# EAGLE design aquarium (EAGLE 9.5.2)

## Sheet 1 of 2
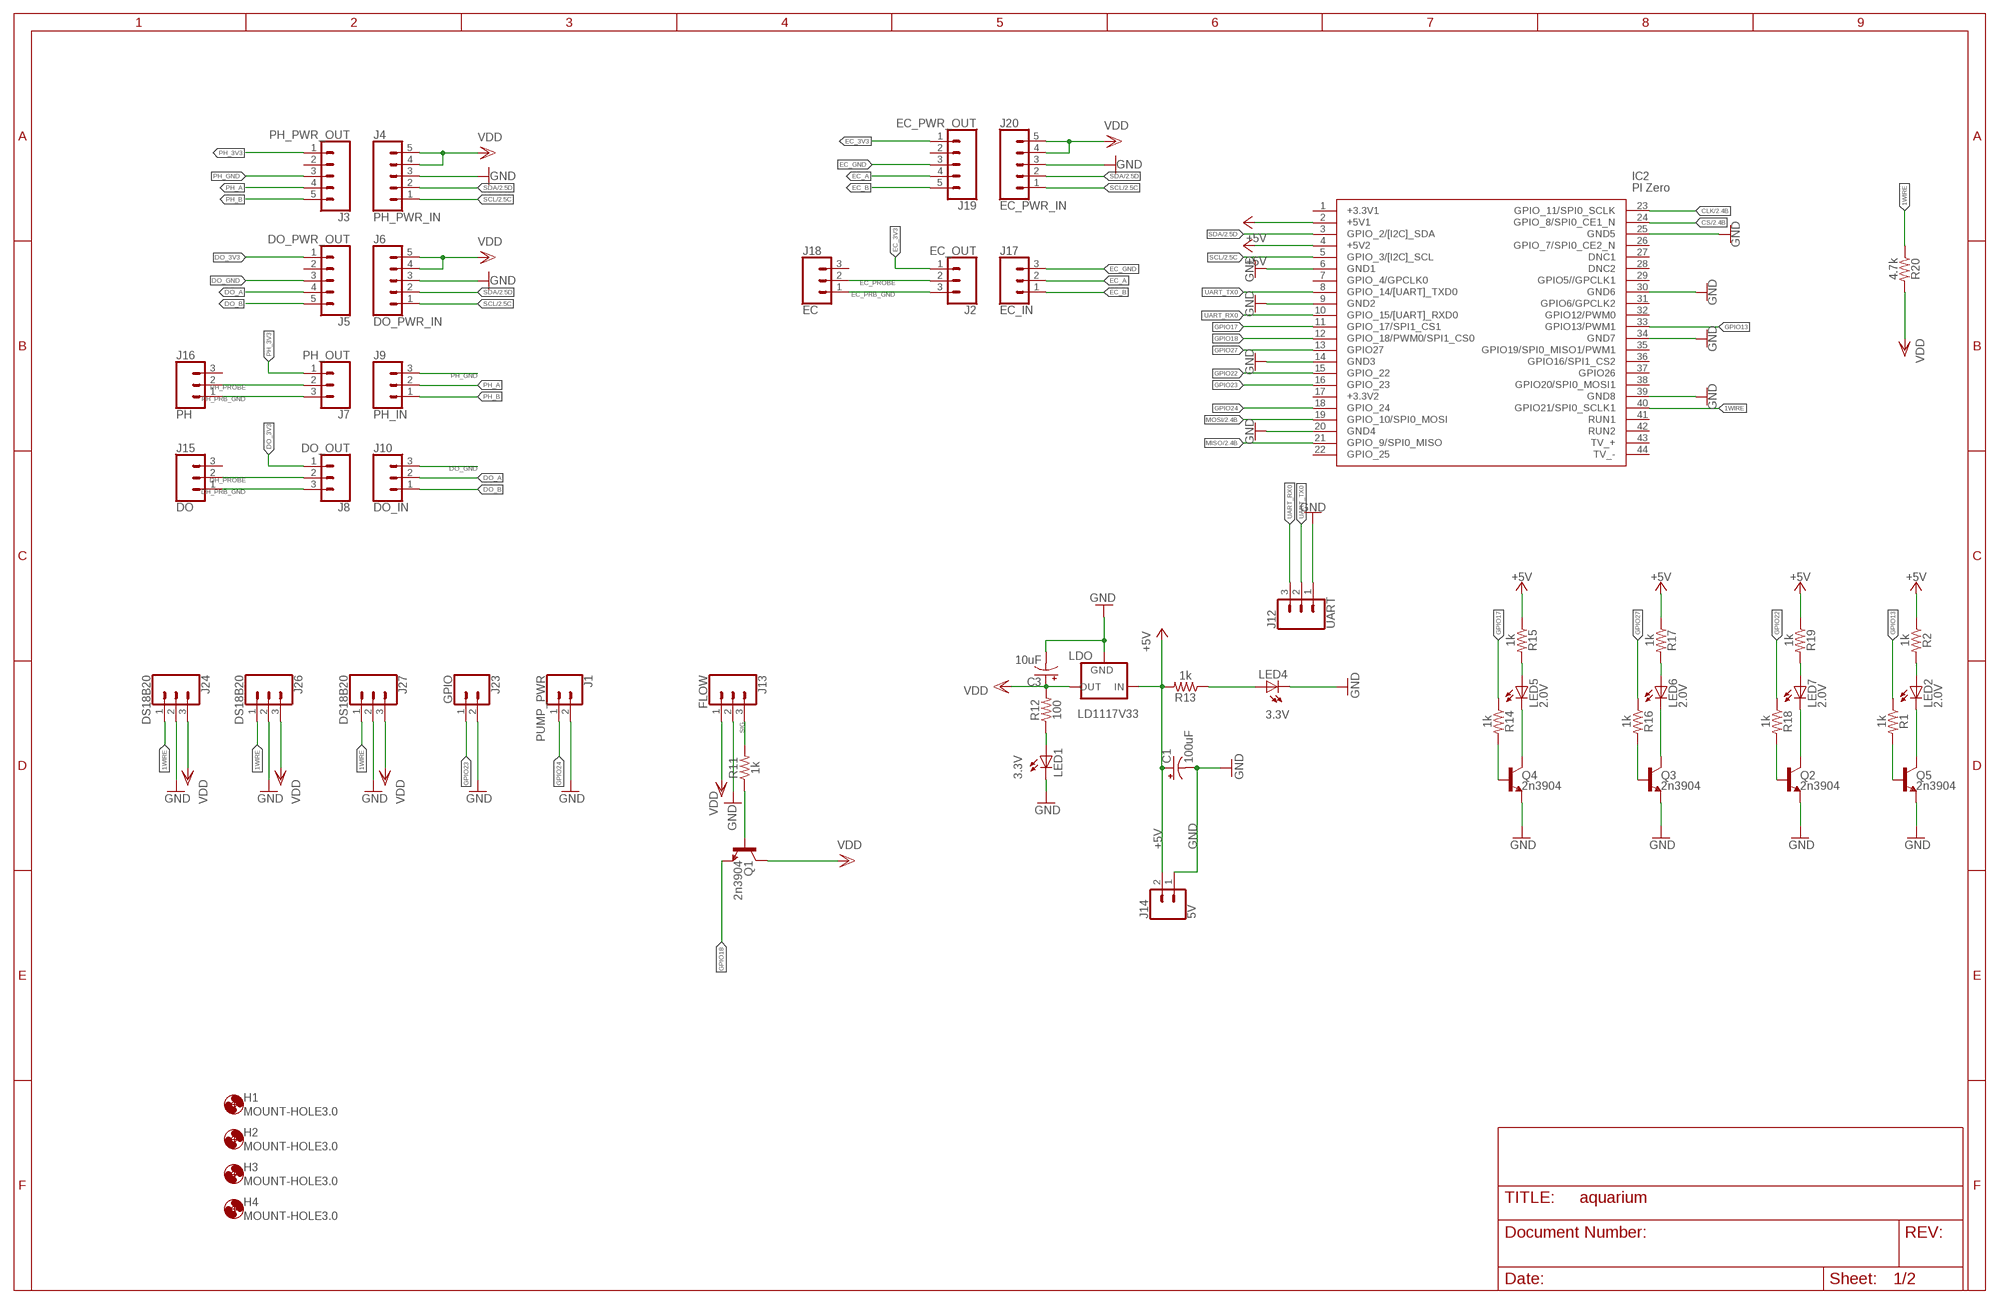
[diagram p0: schematic, sheet 1]

### Parts
C1  100uF  100UF-POLAR-RADIAL-2.5MM-25V-20%  [CPOL-RADIAL-2.5MM-6.5MM]
C3  10uF  10UF-POLAR-RADIAL-2.5MM-25V-20%  [CPOL-RADIAL-2.5MM-5MM]
H1  MOUNT-HOLE3.0  [3,0]
H2  MOUNT-HOLE3.0  [3,0]
H3  MOUNT-HOLE3.0  [3,0]
H4  MOUNT-HOLE3.0  [3,0]
IC2  PI Zero  RASPBERRY_PI_ZERO_W_(V1.3)  [RASPBERRYPIZEROWV13]
J1  PUMP_PWR  CONN_02  [1X02]
J2  EC_OUT  CONN_03  [1X03]
J3  PH_PWR_OUT  CONN_05  [1X05]
J4  PH_PWR_IN  CONN_05  [1X05]
J5  DO_PWR_OUT  CONN_05  [1X05]
J6  DO_PWR_IN  CONN_05  [1X05]
J7  PH_OUT  CONN_03  [1X03]
J8  DO_OUT  CONN_03  [1X03]
J9  PH_IN  CONN_03  [1X03]
J10  DO_IN  CONN_03  [1X03]
J12  UART  CONN_03  [1X03]
J13  FLOW  CONN_03  [1X03]
J14  5V  CONN_02  [1X02]
J15  DO  CONN_03  [1X03]
J16  PH  CONN_03  [1X03]
J17  EC_IN  CONN_03  [1X03]
J18  EC  CONN_03  [1X03]
J19  EC_PWR_OUT  CONN_05  [1X05]
J20  EC_PWR_IN  CONN_05  [1X05]
J23  GPIO  CONN_02  [1X02]
J24  DS18B20  CONN_03  [1X03]
J26  DS18B20  CONN_03  [1X03]
J27  DS18B20  CONN_03  [1X03]
LDO  LD1117V33  V_REG_LD1117VXX  [78XXL]
LED1  3.3V  LED3MM  [LED3MM]
LED2  2.0V  LED3MM  [LED3MM]
LED4  3.3V  LED3MM  [LED3MM]
LED5  2.0V  LED3MM  [LED3MM]
LED6  2.0V  LED3MM  [LED3MM]
LED7  2.0V  LED3MM  [LED3MM]
Q1  2n3904  TRANS_NPN-2N3904  [TO-92]
Q2  2n3904  TRANS_NPN-2N3904  [TO-92]
Q3  2n3904  TRANS_NPN-2N3904  [TO-92]
Q4  2n3904  TRANS_NPN-2N3904  [TO-92]
Q5  2n3904  TRANS_NPN-2N3904  [TO-92]
R1  1k  1KOHM-HORIZ-1/4W-5%  [AXIAL-0.3]
R2  1k  1KOHM-HORIZ-1/4W-5%  [AXIAL-0.3]
R11  1k  1KOHM-HORIZ-1/4W-5%  [AXIAL-0.3]
R12  100  1KOHM-HORIZ-1/4W-5%  [AXIAL-0.3]
R13  1k  1KOHM-HORIZ-1/4W-5%  [AXIAL-0.3]
R14  1k  1KOHM-HORIZ-1/4W-5%  [AXIAL-0.3]
R15  1k  1KOHM-HORIZ-1/4W-5%  [AXIAL-0.3]
R16  1k  1KOHM-HORIZ-1/4W-5%  [AXIAL-0.3]
R17  1k  1KOHM-HORIZ-1/4W-5%  [AXIAL-0.3]
R18  1k  1KOHM-HORIZ-1/4W-5%  [AXIAL-0.3]
R19  1k  1KOHM-HORIZ-1/4W-5%  [AXIAL-0.3]
R20  4.7k  1KOHM-HORIZ-1/4W-5%  [AXIAL-0.3]

### Nets
1WIRE: IC2.40(GPIO21/SPI0_SCLK1) J24.1 J26.1 J27.1 R20.P$1
+5V: C1.1(+) IC2.2(+5V1) IC2.4(+5V2) J14.2 LDO.OUT(IN) R2.P$1 R13.P$2 R15.P$1 R17.P$1 R19.P$1 ; also sheet 2
CLK: IC2.23(GPIO_11/SPI0_SCLK) ; also sheet 2
CS: IC2.24(GPIO_8/SPI0_CE1_N) ; also sheet 2
DH_PRB_GND: J8.3 J15.1
DH_PROBE: J8.2 J15.2
DO_3V3: J5.1 J8.1
DO_A: J5.4 J10.2
DO_B: J5.5 J10.1
DO_GND: J5.3 J10.3
EC_3V3: J2.1 J19.1
EC_A: J17.2 J19.4
EC_B: J17.1 J19.5
EC_GND: J17.3 J19.3
EC_PRB_GND: J2.3 J18.1
EC_PROBE: J2.2 J18.2
GND: C1.2(-) C3.2(-) IC2.6(GND1) IC2.9(GND2) IC2.14(GND3) IC2.20(GND4) IC2.25(GND5) IC2.30(GND6) IC2.34(GND7) IC2.39(GND8) J1.2 J4.3 J6.3 J12.1 J13.2 J14.1 J20.3 J23.2 J24.2 J26.2 J27.2 LDO.IN(GND) LED1.K(C) LED4.K(C) Q2.1(E) Q3.1(E) Q4.1(E) Q5.1(E) ; also sheet 2
GPIO13: IC2.33(GPIO13/PWM1) R1.P$1
GPIO17: IC2.11(GPIO_17/SPI1_CS1) R14.P$1
GPIO18: IC2.12(GPIO_18/PWM0/SPI1_CS0) Q1.1(E)
GPIO22: IC2.15(GPIO_22) R18.P$1
GPIO23: IC2.16(GPIO_23) J23.1
GPIO24: IC2.18(GPIO_24) J1.1
GPIO27: IC2.13(GPIO27) R16.P$1
MISO: IC2.21(GPIO_9/SPI0_MISO) ; also sheet 2
MOSI: IC2.19(GPIO_10/SPI0_MOSI) ; also sheet 2
N$1: LED1.A R12.P$1
N$2: Q1.2(B) R11.P$1
N$3: Q4.2(B) R14.P$2
N$4: LED4.A R13.P$1
N$5: Q3.2(B) R16.P$2
N$6: LED5.A R15.P$2
N$7: Q2.2(B) R18.P$2
N$8: LED5.K(C) Q4.3(C)
N$9: LED6.A R17.P$2
N$10: LED6.K(C) Q3.3(C)
N$11: LED7.A R19.P$2
N$12: LED7.K(C) Q2.3(C)
N$13: Q5.2(B) R1.P$2
N$14: LED2.A R2.P$2
N$15: LED2.K(C) Q5.3(C)
PH_3V3: J3.1 J7.1
PH_A: J3.4 J9.2
PH_B: J3.5 J9.1
PH_GND: J3.3 J9.3
PH_PRB_GND: J7.3 J16.1
PH_PROBE: J7.2 J16.2
SCL: IC2.5(GPIO_3/[I2C]_SCL) J4.1 J6.1 J20.1 ; also sheet 2
SDA: IC2.3(GPIO_2/[I2C]_SDA) J4.2 J6.2 J20.2 ; also sheet 2
SIG: J13.3 R11.P$2
UART_RX0: IC2.10(GPIO_15/[UART]_RXD0) J12.3
UART_TX0: IC2.8(GPIO_14/[UART]_TXD0) J12.2
VDD: C3.1(+) J4.4 J4.5 J6.4 J6.5 J13.1 J20.4 J20.5 J24.3 J26.3 J27.3 LDO.GND(OUT) Q1.3(C) R12.P$2 R20.P$2 ; also sheet 2
Unconnected: IC2.1(+3.3V1) IC2.7(GPIO_4/GPCLK0) IC2.17(+3.3V2) IC2.22(GPIO_25) IC2.26(GPIO_7/SPI0_CE2_N) IC2.27(DNC1) IC2.28(DNC2) IC2.29(GPIO5//GPCLK1) IC2.31(GPIO6/GPCLK2) IC2.32(GPIO12/PWM0) IC2.35(GPIO19/SPI0_MISO1/PWM1) IC2.36(GPIO16/SPI1_CS2) IC2.37(GPIO26) IC2.38(GPIO20/SPI0_MOSI1) IC2.41(RUN1) IC2.42(RUN2) IC2.43(TV_+) IC2.44(TV_-) J3.2 J5.2 J15.3 J16.3 J18.3 J19.2

## Sheet 2 of 2
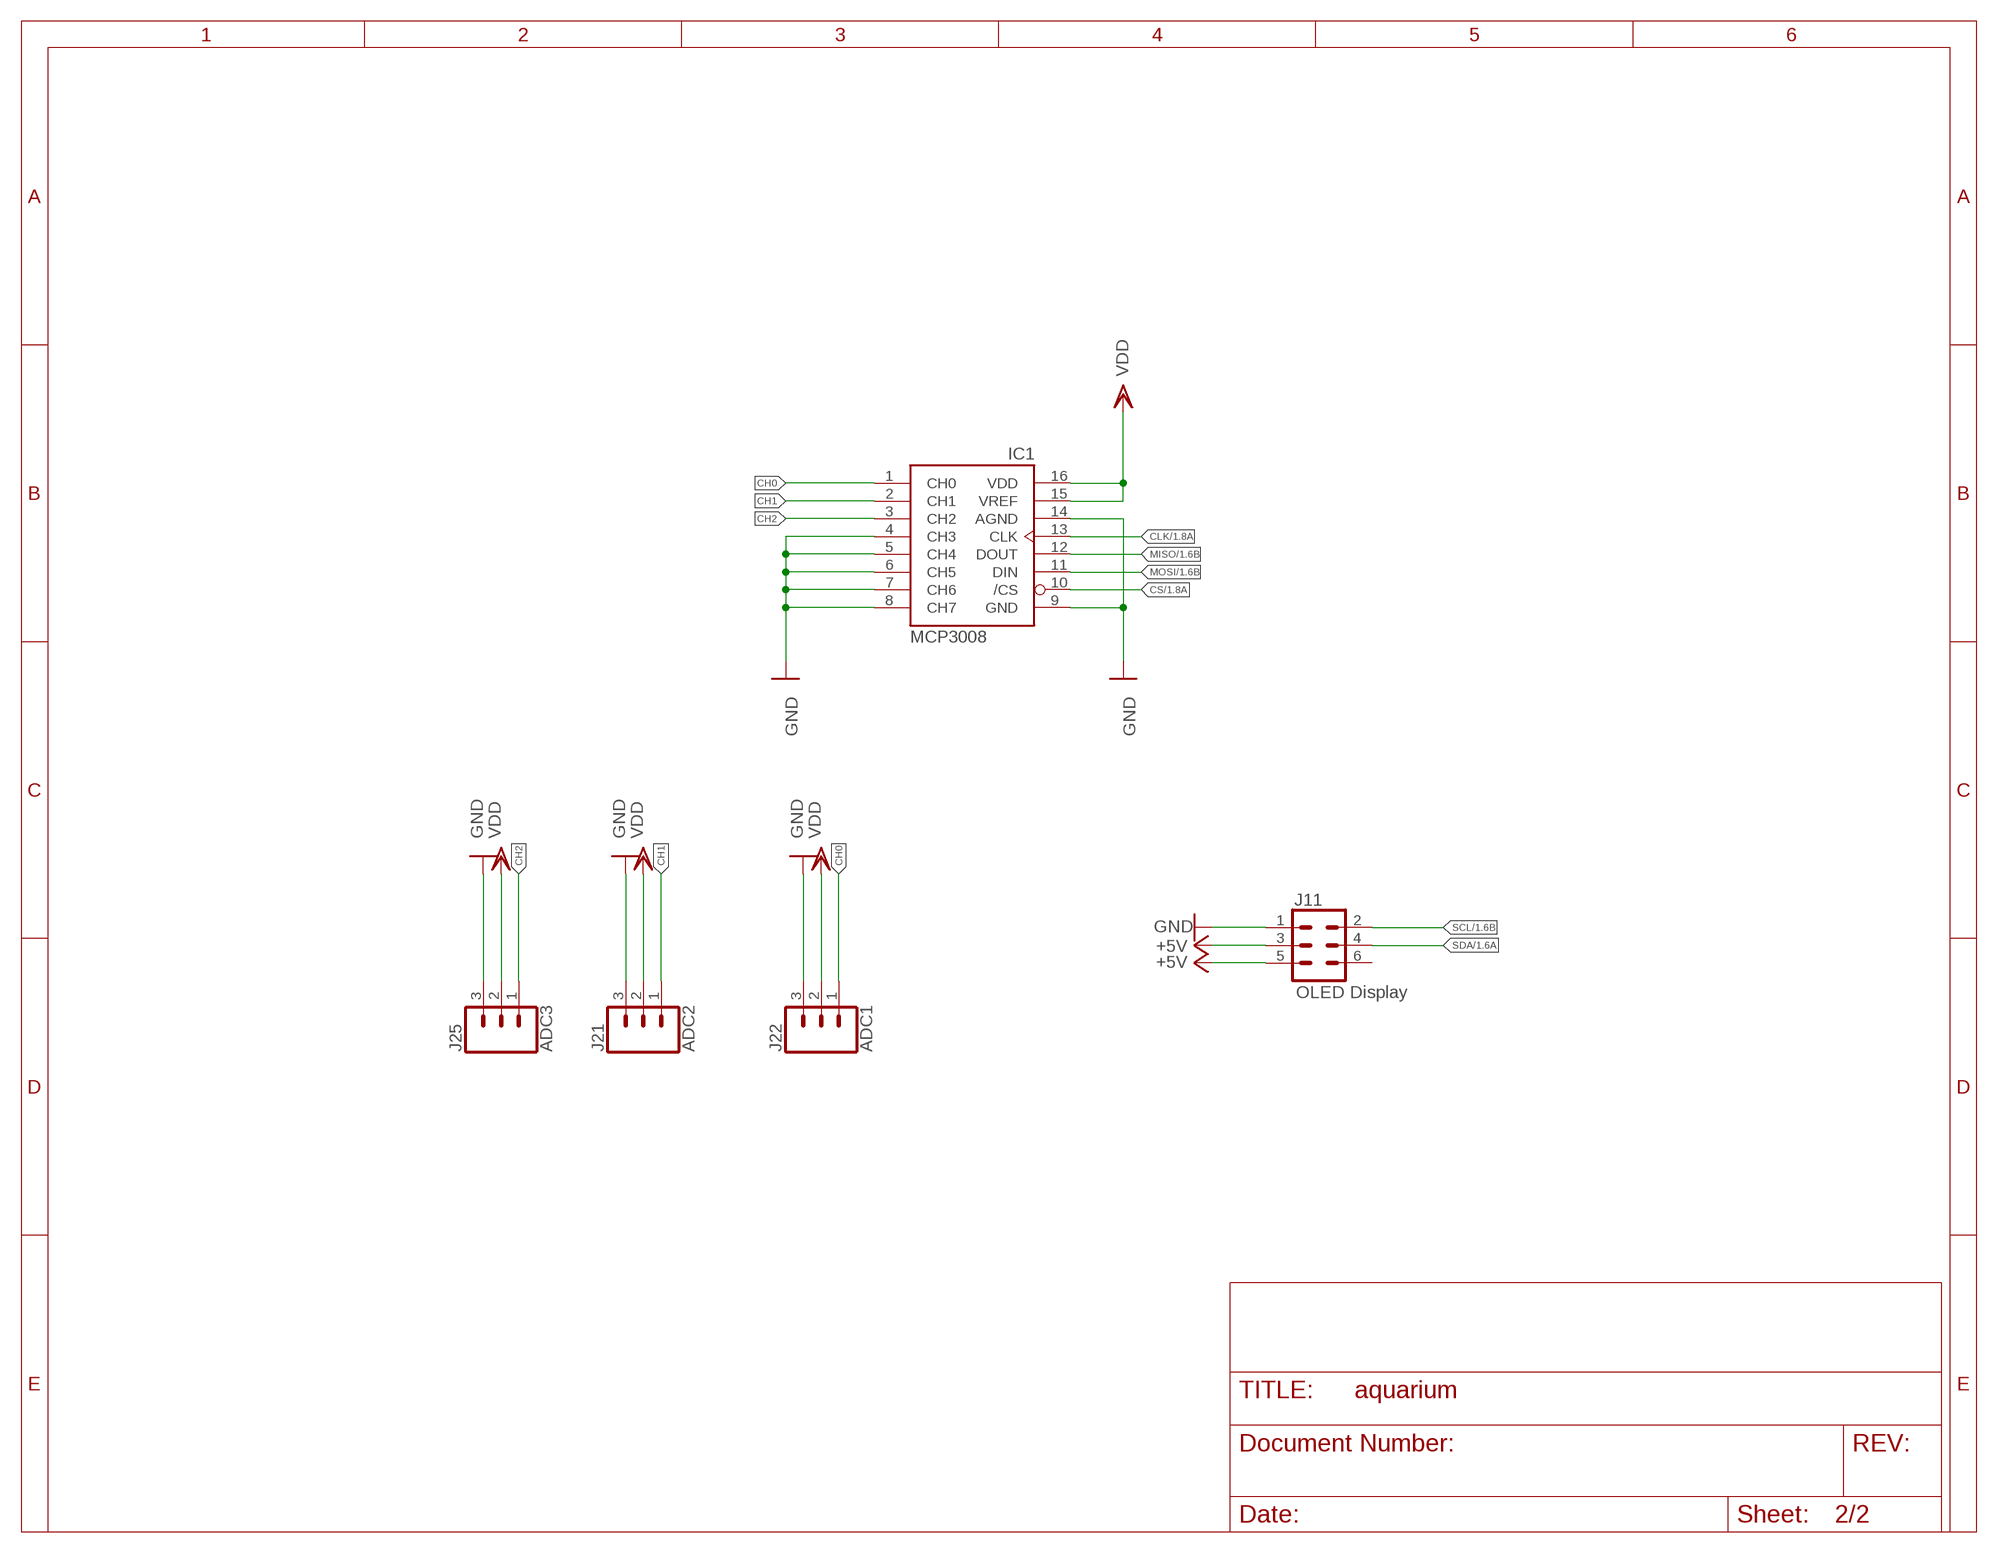
[diagram p1: schematic, sheet 2]

### Parts
IC1  MCP3008  [DIL16]
J11  OLED Display  CONN_03X2FEMALE  [2X3]
J21  ADC2  CONN_03  [1X03]
J22  ADC1  CONN_03  [1X03]
J25  ADC3  CONN_03  [1X03]

### Nets
+5V: J11.3 J11.5 ; also sheet 1
CH0: IC1.1(CH0) J22.1
CH1: IC1.2(CH1) J21.1
CH2: IC1.3(CH2) J25.1
CLK: IC1.13(CLK) ; also sheet 1
CS: IC1.10(/CS) ; also sheet 1
GND: IC1.4(CH3) IC1.5(CH4) IC1.6(CH5) IC1.7(CH6) IC1.8(CH7) IC1.9(GND) IC1.14(AGND) J11.1 J21.3 J22.3 J25.3 ; also sheet 1
MISO: IC1.12(DOUT) ; also sheet 1
MOSI: IC1.11(DIN) ; also sheet 1
SCL: J11.2 ; also sheet 1
SDA: J11.4 ; also sheet 1
VDD: IC1.15(VREF) IC1.16(VDD) J21.2 J22.2 J25.2 ; also sheet 1
Unconnected: J11.6

## Library data of the parts
C1 = SparkFun-Capacitors:100UF-POLAR: 100µF polarized capacitors A capacitor is a passive two-terminal electrical component used to store electrical energy temporarily in an electric field.; PROD_ID: CAP-08439
C3 = SparkFun-Capacitors:10UF-POLAR: 10.0µF polarized capacitors A capacitor is a passive two-terminal electrical component used to store electrical energy temporarily in an electric field.; PROD_ID: CAP-08440
H1-H4 = holes:MOUNT-HOLE: MOUNTING HOLE with drill center marker
IC1 = adafruit:MCP3008
IC2 = Rasbperry_Pi_Zero_W:RASPBERRY_PI_ZERO_W_(V1.3): Raspberry Pi Zero W (v1.3) Single-board Computers Source: Datasheet <https://cdn.sparkfun.com/assets/learn_tutorials/6/7/6/PiZero_1.pdf>; ARROW_PART_NUMBER: Raspberry Pi Zero W (v1.3); DESCRIPTION: Raspberry Pi Zero W (v1.3) Single-board Computers; HEIGHT: mm; MANUFACTURER_NAME: RASPBERRY-PI; MANUFACTURER_PART_NUMBER: Raspberry Pi Zero W (v1.3)
J1 J14 J23 = SparkFun-Connectors:CONN_02: Multi connection point. Often used as Generic Header-pin footprint for 0.1 inch spaced/style header connections On any of the 0.1 inch spaced packages, you can populate with these: Break Away Headers - Straight <https://www.sparkfun.com/products/116> (PRT-00116) Break Away Male Headers - Right Angle <https://www.sparkfun.com/products/553> (PRT-00553) Female Headers <https://www.sparkfun.com/products/115> (PRT-00115) Break Away Headers - Machine Pin <https://www.sparkfun.com/products/117> (PRT-00117) Break Away Female Headers - Swiss Machine Pin <https://www.sparkfun.com/products/743> (PRT-00743) For SCREWTERMINALS and SPRING TERMINALS visit here: Screw Terimnals on SparkFun.com <https://www.sparkfun.com/search/results?term=Screw+Terminals> (5mm/3.5mm/2.54mm spacing) This device is also useful as a general connection point to wire up your design to another part of your project. Our various solder wires solder well into these plated through hole pads. Hook-Up Wire - Assortment (Stranded, 22 AWG) <https://www.sparkfun.com/products/11375> (PRT-11375) Hook-Up Wire - Assortment (Solid Core, 22 AWG) <https://www.sparkfun.com/products/11367> (PRT-11367) View the entire wire category on our website here <https://www.sparkfun.com/categories/141> Special notes: Molex polarized connector foot print use with: PRT-08233 with associated crimp pins and housings. 2.54_SCREWTERM for use with PRT-10571. 3.5mm Screw Terminal footprints for PRT-08084 5mm Screw Terminal footprints for use with PRT-08432
J2 J7-J10 J12 J13 J15-J18 J21 J22 J24-J27 = SparkFun-Connectors:CONN_03: Multi connection point. Often used as Generic Header-pin footprint for 0.1 inch spaced/style header connections On any of the 0.1 inch spaced packages, you can populate with these: Break Away Headers - Straight <https://www.sparkfun.com/products/116> (PRT-00116) Break Away Male Headers - Right Angle <https://www.sparkfun.com/products/553> (PRT-00553) Female Headers <https://www.sparkfun.com/products/115> (PRT-00115) Break Away Headers - Machine Pin <https://www.sparkfun.com/products/117> (PRT-00117) Break Away Female Headers - Swiss Machine Pin <https://www.sparkfun.com/products/743> (PRT-00743) Stackable Header - 3 Pin (Female, 0.1") <https://www.sparkfun.com/products/13875> (PRT-13875) For SCREWTERMINALS and SPRING TERMINALS visit here: Screw Terimnals on SparkFun.com <https://www.sparkfun.com/search/results?term=Screw+Terminals> (5mm/3.5mm/2.54mm spacing) This device is also useful as a general connection point to wire up your design to another part of your project. Our various solder wires solder well into these plated through hole pads. Hook-Up Wire - Assortment (Stranded, 22 AWG) <https://www.sparkfun.com/products/11375> (PRT-11375) Hook-Up Wire - Assortment (Solid Core, 22 AWG) <https://www.sparkfun.com/products/11367> (PRT-11367) View the entire wire category on our website here <https://www.sparkfun.com/categories/141> Special notes: Molex polarized connector foot print use with SKU : PRT-08232 with associated crimp pins and housings.
J3-J6 J19 J20 = SparkFun-Connectors:CONN_05: Multi connection point. Often used as Generic Header-pin footprint for 0.1 inch spaced/style header connections On any of the 0.1 inch spaced packages, you can populate with these: Break Away Headers - Straight <https://www.sparkfun.com/products/116> (PRT-00116) Break Away Male Headers - Right Angle <https://www.sparkfun.com/products/553> (PRT-00553) Female Headers <https://www.sparkfun.com/products/115> (PRT-00115) Break Away Headers - Machine Pin <https://www.sparkfun.com/products/117> (PRT-00117) Break Away Female Headers - Swiss Machine Pin <https://www.sparkfun.com/products/743> (PRT-00743) For SCREWTERMINALS and SPRING TERMINALS visit here: Screw Terimnals on SparkFun.com <https://www.sparkfun.com/search/results?term=Screw+Terminals> (5mm/3.5mm/2.54mm spacing) This device is also useful as a general connection point to wire up your design to another part of your project. Our various solder wires solder well into these plated through hole pads. Hook-Up Wire - Assortment (Stranded, 22 AWG) <https://www.sparkfun.com/products/11375> (PRT-11375) Hook-Up Wire - Assortment (Solid Core, 22 AWG) <https://www.sparkfun.com/products/11367> (PRT-11367) View the entire wire category on our website here <https://www.sparkfun.com/categories/141> Special notes: Molex polarized connector foot print use with SKU : PRT-08231 with associated crimp pins and housings. 1MM SMD Version SKU: PRT-10208
J11 = SparkFun-Connectors:CONN_03X2: Multi connection point. Often used as Generic Header-pin footprint for 0.1 inch spaced/style header connections You can populate with any combo of single row headers, but if you'd like an exact match, check these: Header - 2x3 (Male, 0.1") <https://www.sparkfun.com/products/12807> (PRT-12807) Header - 2x3 (Female, 0.1") <https://www.sparkfun.com/products/13010> (PRT-13010) 2x3 Pin Shrouded Header <https://www.sparkfun.com/products/10877> (PRT-10877) On any of the 0.1 inch spaced packages, you can populate with these: Break Away Headers - Straight <https://www.sparkfun.com/products/116> (PRT-00116) Break Away Male Headers - Right Angle <https://www.sparkfun.com/products/553> (PRT-00553) Female Headers <https://www.sparkfun.com/products/115> (PRT-00115) Break Away Headers - Machine Pin <https://www.sparkfun.com/products/117> (PRT-00117) Break Away Female Headers - Swiss Machine Pin <https://www.sparkfun.com/products/743> (PRT-00743) Special note: the shrouded connector mates well with our 3x2 ribbon cables: Ribbon Crimp Connector - 6-pin (2x3, Female) <https://www.sparkfun.com/products/10651> (PRT-10651) Ribbon Cable - 6 wire (15ft) <https://www.sparkfun.com/products/10646> (PRT-10646); PROD_ID: CONN-11566; VALUE: FEMALE 2x3
LDO = SparkFun-IC-Power:V_REG_LD1117VXX: LD1117VXX voltage regulator. We carry the 3.3V version (COM-00526) in TO-220 package.
LED1 LED2 LED4-LED7 = adafruit:LED: LED OSRAM: - CHIPLED LG R971, LG N971, LY N971, LG Q971, LY Q971, LO R971, LY R971 LH N974, LH R974 LS Q976, LO Q976, LY Q976 LO Q996 - Hyper CHIPLED LW Q18S LB Q993, LB Q99A, LB R99A - SideLED LS A670, LO A670, LY A670, LG A670, LP A670 LB A673, LV A673, LT A673, LW A673 LH A674 LY A675 LS A676, LA A676, LO A676, LY A676, LW A676 LS A679, LY A679, LG A679 - Hyper Micro SIDELED® LS Y876, LA Y876, LO Y876, LY Y876 LT Y87S - SmartLED LW L88C, LW L88S LB L89C, LB L89S, LG L890 LS L89K, LO L89K, LY L89K LS L896, LA L896, LO L896, LY L896 - TOPLED LS T670, LO T670, LY T670, LG T670, LP T670 LSG T670, LSP T670, LSY T670, LOP T670, LYG T670 LG T671, LOG T671, LSG T671 LB T673, LV T673, LT T673, LW T673 LH T674 LS T676, LA T676, LO T676, LY T676, LB T676, LH T676, LSB T676, LW T676 LB T67C, LV T67C, LT T67C, LS T67K, LO T67K, LY T67K, LW E67C LS E67B, LA E67B, LO E67B, LY E67B, LB E67C, LV E67C, LT E67C LW T67C LS T679, LY T679, LG T679 LS T770, LO T770, LY T770, LG T770, LP T770 LB T773, LV T773, LT T773, LW T773 LH T774 LS E675, LA E675, LY E675, LS T675 LS T776, LA T776, LO T776, LY T776, LB T776 LHGB T686 LT T68C, LB T68C - Hyper Mini TOPLED® LB M676 - Mini TOPLED Santana® LG M470 LS M47K, LO M47K, LY M47K Source: http://www.osram.convergy.de/
Q1-Q5 = SparkFun-DiscreteSemi:TRANS_NPN: NPN transistor Current controlled devices typically used to amplify current or used as a switch. BC547 - COM-08928 <http://www.sparkfun.com/products/8928> (TO-92 45V 100mA) (1.Collector 2.Base 3.Emitter) 2N3904 - COM-00521 <http://www.sparkfun.com/products/521> (TO-92 40V 200mA) (1.Emitter 2.Base 3.Collector) P2N2222A - COM-12852 <http://www.sparkfun.com/products/12852> (TO-92 40V 600mA) (1.Collector 2.Base 3.Emitter); PROD_ID: TRANS-08447; VALUE: 200mA/40V
R1 R2 R11 R13-R19 = SparkFun-Resistors:1KOHM: 1kΩ resistor A resistor is a passive two-terminal electrical component that implements electrical resistance as a circuit element. Resistors act to reduce current flow, and, at the same time, act to lower voltage levels within circuits. - Wikipedia; PROD_ID: RES-08380
R12 R20 = SparkFun-Resistors:1KOHM: 1kΩ resistor A resistor is a passive two-terminal electrical component that implements electrical resistance as a circuit element. Resistors act to reduce current flow, and, at the same time, act to lower voltage levels within circuits. - Wikipedia; PROD_ID: RES-08380; VALUE: 1k

## Board
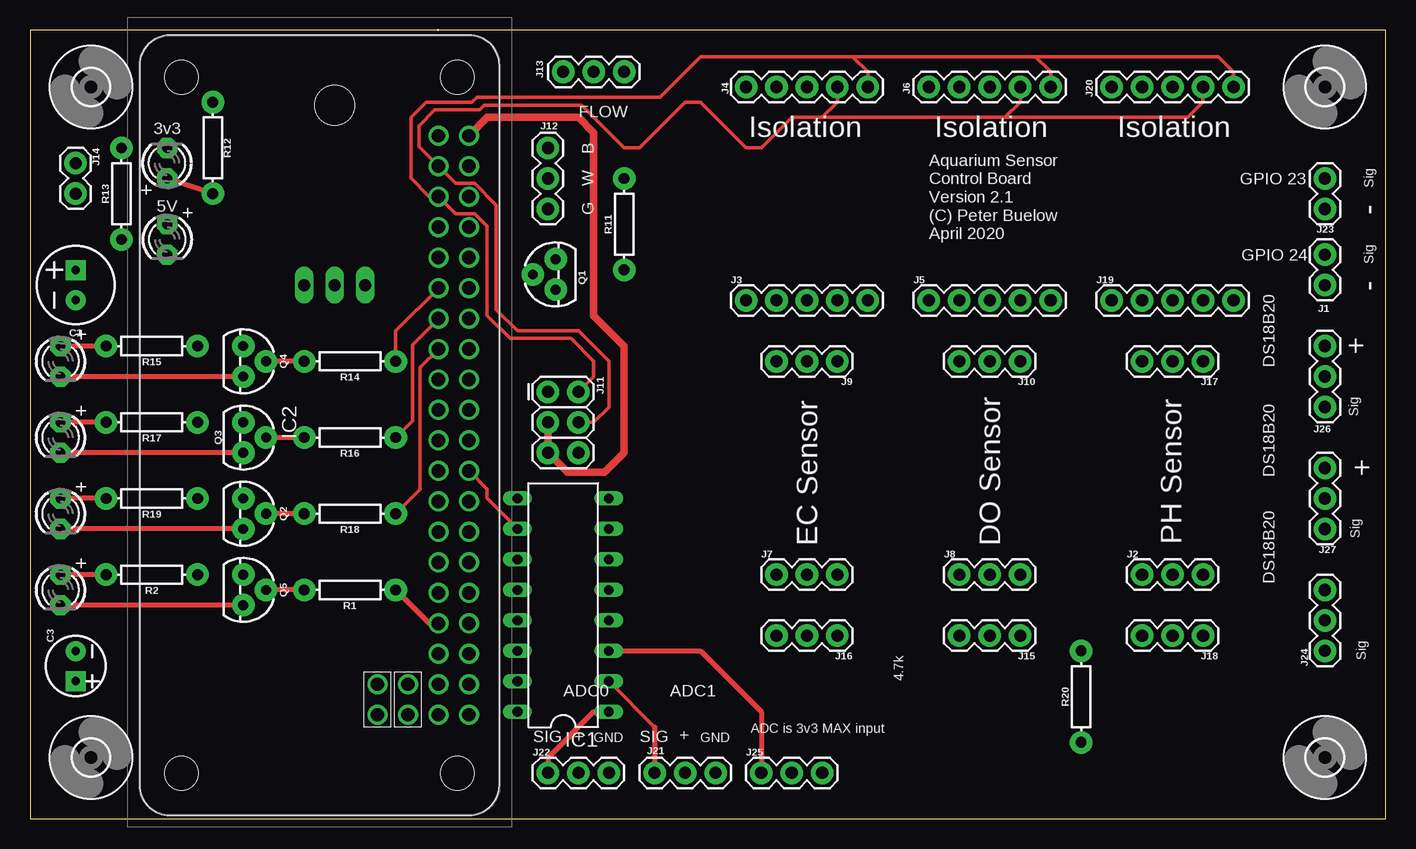
[diagram p2: board, top side]
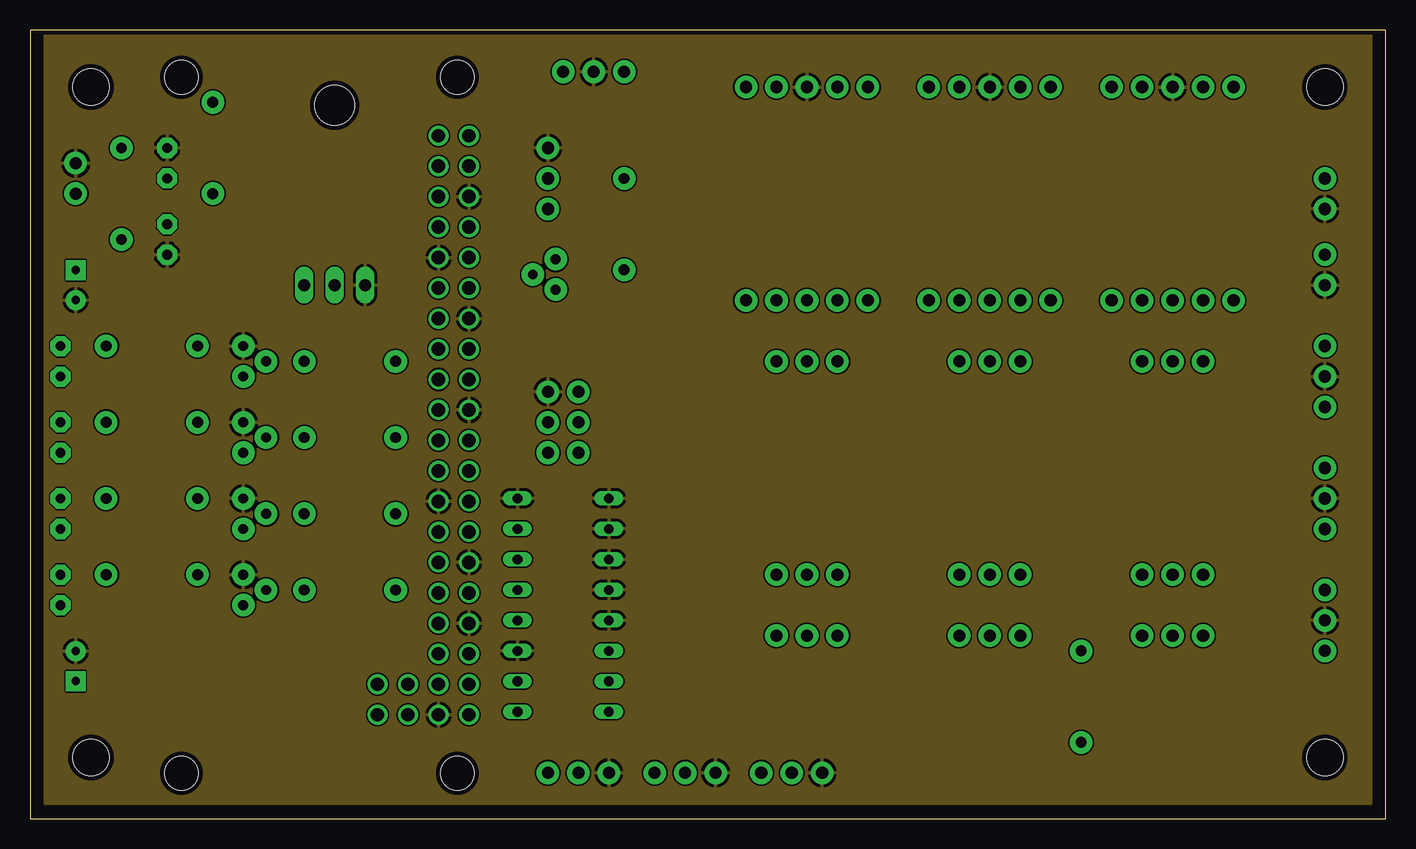
[diagram p3: board, inner layer Route2]
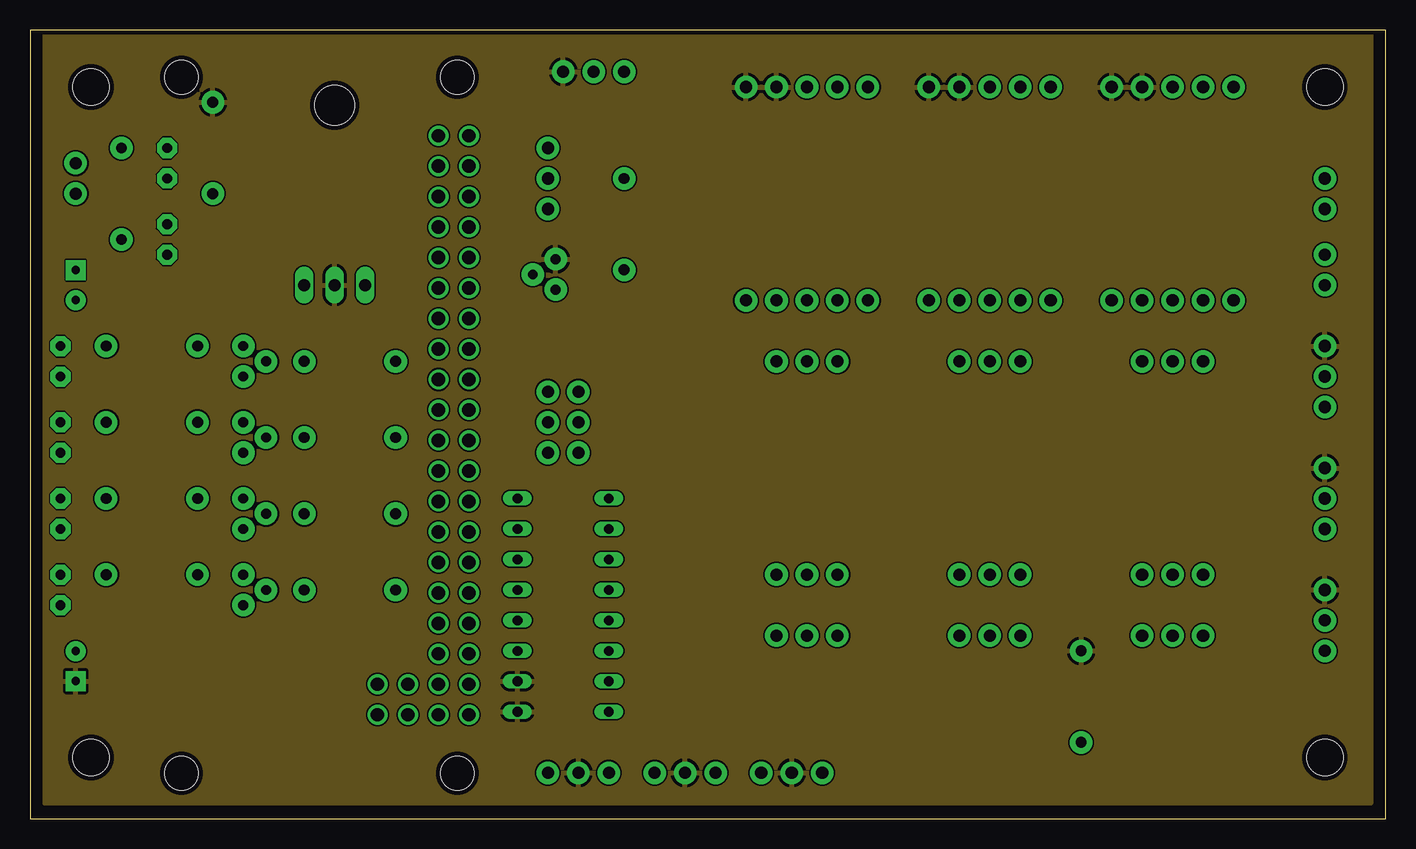
[diagram p4: board, inner layer Route15]
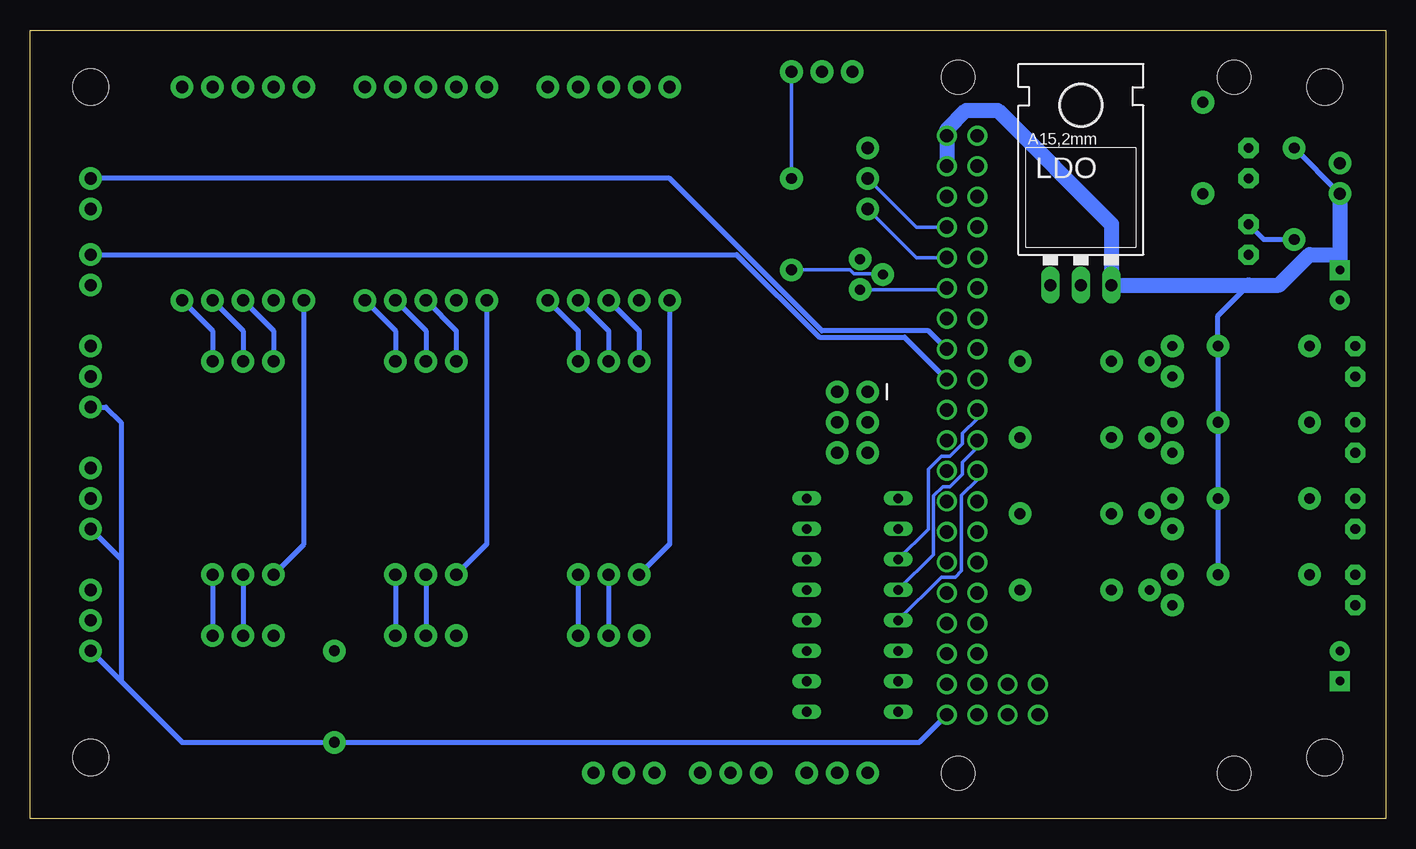
[diagram p5: board, bottom side, seen from below]

Size 113.01 x 65.71 mm. Coordinates in mm from the lower left corner, seen from the top.
Outline: 0,0 113.01,0 113.01,65.71 0,65.71 0,0
Copper layers (1*2*15*16): Top 0.035559375mm / dielectric 0.17018125mm / Route2 0.01778125mm / dielectric 47mil / Route15 0.01778125mm / dielectric 0.17018125mm / Bottom 0.035559375mm
Design rules "oshpark-4layer": minimum track width 5mil, minimum drill 10mil, track to track 5mil, track to pad 5mil, pad to pad 5mil, via to via 5mil, smd to smd 5mil, copper to edge 15mil, drill to drill 6mil, minimum pad ring 4mil, minimum via ring 4mil, stop-mask expansion 2.5mil, vias tented up to drill 0mil, thermal gap 10mil

### Footprints (pad centres in the part's own frame; a part is rotated, then mirrored left to right if it is on the bottom)
CPOL-RADIAL-2.5MM-6.5MM = drill 0.7 pad 1.651 square: 1 1.25,0 | drill 0.7 pad 1.651: 2 -1.25,0
CPOL-RADIAL-2.5MM-5MM = drill 0.7 pad 1.651 square: 1 1.25,0 | drill 0.7 pad 1.651: 2 -1.25,0
3,0 = hole 3: 0,0
DIL16 = drill 0.813 long: 1 -8.89,-3.81; 2 -6.35,-3.81; 3 -3.81,-3.81; 4 -1.27,-3.81; 5 1.27,-3.81; 6 3.81,-3.81; 7 6.35,-3.81; 8 8.89,-3.81; 9 8.89,3.81; 10 6.35,3.81; 11 3.81,3.81; 12 1.27,3.81; 13 -1.27,3.81; 14 -3.81,3.81; 15 -6.35,3.81; 16 -8.89,3.81
RASPBERRYPIZEROWV13 = drill 1.11: 1 -23.885,9.92; 2 -23.885,12.46; 3 -21.345,9.92; 4 -21.345,12.46; 5 -18.805,9.92; 6 -18.805,12.46; 7 -16.265,9.92; 8 -16.265,12.46; 9 -13.725,9.92; 10 -13.725,12.46; 11 -11.185,9.92; 12 -11.185,12.46; 13 -8.645,9.92; 14 -8.645,12.46; 15 -6.105,9.92; 16 -6.105,12.46; 17 -3.565,9.92; 18 -3.565,12.46; 19 -1.025,9.92; 20 -1.025,12.46; 21 1.515,9.92; 22 1.515,12.46; 23 4.055,9.92; 24 4.055,12.46; 25 6.595,9.92; 26 6.595,12.46; 27 9.135,9.92; 28 9.135,12.46; 29 11.675,9.92; 30 11.675,12.46; 31 14.215,9.92; 32 14.215,12.46; 33 16.755,9.92; 34 16.755,12.46; 35 19.295,9.92; 36 19.295,12.46; 37 21.835,9.92; 38 21.835,12.46; 39 24.375,9.92; 40 24.375,12.46; 41 24.375,7.38; 42 21.835,7.38; 43 21.835,4.84; 44 24.375,4.84 | hole 2.8: -28.755,11.5; -28.755,-11.5; 29.245,-11.5; 29.245,11.5
1X02 = drill 1.016 pad 1.88: 1 0,0; 2 2.54,0
1X03 = drill 1.016 pad 1.88: 1 0,0; 2 2.54,0; 3 5.08,0
1X05 = drill 1.016 pad 1.88: 1 0,0; 2 2.54,0; 3 5.08,0; 4 7.62,0; 5 10.16,0
2X3 = drill 1.016 pad 1.88: 1 0,0; 2 0,2.54; 3 2.54,0; 4 2.54,2.54; 5 5.08,0; 6 5.08,2.54
78XXL = drill 1.016 long: GND 0,-3.81; IN -2.54,-3.81; OUT 2.54,-3.81 | hole 3.302: 0,11.176
LED3MM = drill 0.813 pad 1.676 octagon: A -1.27,0; K 1.27,0
TO-92 = drill 0.813 pad 1.88: 1 -1.27,0; 2 0,1.905; 3 1.27,0
AXIAL-0.3 = drill 0.9 pad 1.88: P$1 -3.81,0; P$2 3.81,0

### Placement (x,y rotation side)
C1  3.81,44.45 90 top
C3  3.81,12.7 270 top
H1  107.95,60.96 0 top
H2  107.95,5.08 0 top
H3  5.08,5.08 0 top
H4  5.08,60.96 0 top
IC1  44.45,17.78 90 top
IC2  24.13,33.02 270 top
J1  107.95,46.99 270 top
J2  92.71,20.32 0 top
J3  59.69,43.18 0 top
J4  69.85,60.96 180 top
J5  74.93,43.18 0 top
J6  85.09,60.96 180 top
J7  62.23,20.32 0 top
J8  77.47,20.32 0 top
J9  67.31,38.1 180 top
J10  82.55,38.1 180 top
J11  43.18,35.56 270 top
J12  43.18,55.88 270 top
J13  44.45,62.23 0 top
J14  3.81,54.61 270 top
J15  82.55,15.24 180 top
J16  67.31,15.24 180 top
J17  97.79,38.1 180 top
J18  97.79,15.24 180 top
J19  90.17,43.18 0 top
J20  100.33,60.96 180 top
J21  52.07,3.81 0 top
J22  43.18,3.81 0 top
J23  107.95,53.34 270 top
J24  107.95,13.97 90 top
J25  60.96,3.81 0 top
J26  107.95,34.29 90 top
J27  107.95,24.13 90 top
LDO  25.4,48.26 0 bottom
LED1  11.43,54.61 90 top
LED2  2.54,19.05 270 top
LED4  11.43,48.26 270 top
LED5  2.54,38.1 270 top
LED6  2.54,31.75 270 top
LED7  2.54,25.4 270 top
Q1  43.81,45.34 90 top
Q2  17.78,25.4 270 top
Q3  17.78,31.75 270 top
Q4  17.78,38.1 270 top
Q5  17.78,19.05 270 top
R1  26.67,19.05 180 top
R2  10.16,20.32 180 top
R11  49.53,49.53 90 top
R12  15.24,55.88 90 top
R13  7.62,52.07 90 top
R14  26.67,38.1 180 top
R15  10.16,39.37 180 top
R16  26.67,31.75 180 top
R17  10.16,33.02 180 top
R18  26.67,25.4 180 top
R19  10.16,26.67 180 top
R20  87.63,10.16 90 top

### Tracks (layer width: path | path; a pad name or v marks a point on that pad's centre or on a via)
1WIRE
  Bottom 0.406: J24.1 105.41,11.43 | 105.41,11.43 100.33,6.35 R20.P$1 38.88,6.35 IC2.40 | J26.1 106.68,34.29 105.41,33.02 105.41,21.59 | 105.41,21.59 105.41,11.43 | J27.1 105.41,21.59
+5V
  Top 0.61: IC2.2 38.1,58.42 45.72,58.42 46.99,57.15 46.99,41.91 49.53,39.37 49.53,30.48 47.9,28.85 44.81,28.85 J11.5 J11.3
  Bottom 0.406: 11.43,44.45 13.97,41.91 R15.P$1 R17.P$1 R19.P$1 R2.P$1 | J14.2 R13.P$2
  Bottom 1.27: J14.2 3.81,46.99 | 3.81,46.99 C1.1 | IC2.4 IC2.2 36.59,57.39 34.97,59.01 32.34,59.01 22.86,49.53 LDO.OUT 11.43,44.45 8.89,44.45 6.35,46.99 3.81,46.99
CH0
  Top 0.406: IC1.1 46.99,8.89 43.18,5.08 J22.1
CH1
  Top 0.305: IC1.2 52.07,7.62
  Top 0.406: 52.07,7.62 J21.1
CH2
  Top 0.406: IC1.3 55.88,13.97 60.96,8.89 J25.1
CLK
  Bottom 0.305: IC2.23 34.05,28.25 35.35,26.95 35.35,20.63 35.88,20.11 37.04,20.11 IC1.13
CS
  Top 0.305: IC1.10 38.1,26.67 38.1,27.46 IC2.24
DH_PRB_GND
  Bottom 0.406: J8.3 J15.1
DH_PROBE
  Bottom 0.406: J8.2 J15.2
DO_3V3
  Bottom 0.406: J5.1 74.93,22.86 J8.1
DO_A
  Bottom 0.406: J5.4 80.01,40.64 J10.2
DO_B
  Bottom 0.406: J5.5 82.55,40.64 J10.1
DO_GND
  Bottom 0.406: J5.3 77.47,40.64 J10.3
EC_3V3
  Bottom 0.406: J2.1 90.17,22.86 J19.1
EC_A
  Bottom 0.406: J19.4 95.25,40.64 J17.2
EC_B
  Bottom 0.406: J19.5 97.79,40.64 J17.1
EC_GND
  Bottom 0.406: J19.3 92.71,40.64 J17.3
EC_PRB_GND
  Bottom 0.406: J2.3 J18.1
EC_PROBE
  Bottom 0.406: J2.2 J18.2
GND
  pour Route2: 1.27,66.04 111.76,66.04 111.76,1.27 1.27,1.27
GPIO13
  Top 0.406: IC2.33 33.27,16.27 R1.P$1
GPIO17
  Top 0.305: IC2.11 30.48,40.63 R14.P$1
GPIO18
  Bottom 0.305: Q1.1 36.73,44.07 IC2.12
GPIO22
  Top 0.305: IC2.15 32.53,37.6 32.53,27.45 R18.P$1
GPIO23
  Bottom 0.406: IC2.16 38.1,40.64 46.99,40.64 59.69,53.34 J23.1
GPIO24
  Bottom 0.406: J1.1 54.09,46.99 47.21,40.11 40.11,40.11 IC2.18
GPIO27
  Top 0.305: IC2.13 31.88,39.49 31.88,33.15 R16.P$1
MISO
  Bottom 0.305: IC1.12 37.7,21.99 37.7,26.89 36.92,27.66 36.32,27.66 35.29,28.69 35.29,29.68 34.05,30.92 IC2.21
MOSI
  Bottom 0.305: IC1.11 38.13,24.1 38.13,29.12 37.05,30.2 36.32,30.2 35.29,31.23 35.29,32.09 34.05,33.33 IC2.19
N$1
  Top 0.406: R12.P$1 LED1.A
N$2
  Bottom 0.305: R11.P$1 44.65,45.72 44.32,45.39 41.96,45.39 Q1.2
N$3
  Top 0.406: R14.P$2 Q4.2
N$4
  Bottom 0.406: LED4.A 10.16,48.26 R13.P$1
N$5
  Top 0.406: R16.P$2 Q3.2
N$6
  Top 0.406: R15.P$2 LED5.A
N$7
  Top 0.406: R18.P$2 Q2.2
N$8
  Top 0.406: Q4.3 LED5.K
N$9
  Top 0.406: R17.P$2 LED6.A
N$10
  Top 0.406: Q3.3 LED6.K
N$11
  Top 0.406: R19.P$2 LED7.A
N$12
  Top 0.406: Q2.3 LED7.K
N$13
  Top 0.406: R1.P$2 Q5.2
N$14
  Top 0.406: R2.P$2 LED2.A
N$15
  Top 0.406: Q5.3 LED2.K
PH_3V3
  Bottom 0.406: J7.1 59.69,22.86 J3.1
PH_A
  Bottom 0.406: J3.4 64.77,40.64 J9.2
PH_B
  Bottom 0.406: J3.5 67.31,40.64 J9.1
PH_GND
  Bottom 0.406: J3.3 62.23,40.64 J9.3
PH_PRB_GND
  Bottom 0.406: J7.3 J16.1
PH_PROBE
  Bottom 0.406: J7.2 J16.2
SCL
  Top 0.305: 68.58,63.5 55.88,63.5 52.5,60.12 37.26,60.12 36.83,59.69 33.02,59.69 31.75,58.42 31.75,53.34 33.27,51.82 IC2.5 35.48,50.4 37.05,50.4 38.1,49.35 38.1,41.91 40.01,40 45.09,40 46.99,38.1 46.99,36.83 J11.2 | 68.58,63.5 69.85,62.23 J4.1 | 68.58,63.5 83.82,63.5 | 83.82,63.5 85.09,62.23 J6.1 | 83.82,63.5 99.06,63.5 100.33,62.23 J20.1
SDA
  Top 0.305: J4.2 67.31,59.69 66.04,58.42 | 66.04,58.42 63.5,58.42 60.96,55.88 59.69,55.88 55.88,59.69 54.61,59.69 50.8,55.88 49.53,55.88 45.97,59.44 37.85,59.44 37.47,59.05 33.74,59.05 32.43,57.75 32.43,55.98 IC2.3 35.48,52.94 37.05,52.94 38.86,51.12 38.86,42.42 40.64,40.64 45.72,40.64 48.26,38.1 48.26,34.29 46.99,33.02 J11.4 | J20.2 97.79,59.69 96.52,58.42 81.28,58.42 | 81.28,58.42 66.04,58.42 | J6.2 82.55,59.69 81.28,58.42
SIG
  Bottom 0.305: J13.3 R11.P$2
UART_RX0
  Bottom 0.305: J12.3 39.12,46.74 IC2.10
UART_TX0
  Bottom 0.305: J12.2 39.12,49.28 IC2.8
VDD
  pour Route15: 1.27,66.04 111.76,66.04 111.76,1.27 1.27,1.27

### Text on the board
_tsilk: FLOW | Isolation | Isolation | Isolation | 3v3 | B | W | GPIO 23 | Sig | 5V | G | - | Aquarium Sensor / Control Board / Version 2.1 / (C) Peter Buelow / April 2020 | GPIO 24 | Sig | - | + | DS18B20 | Sig | + | DS18B20 | Sig | EC Sensor | DO Sensor | PH Sensor | DS18B20 | 4.7k | Sig | ADC0 | ADC1 | SIG | + | GND | SIG | + | GND | ADC is 3v3 MAX input